# EAGLE schematic Ham-Dip-V2-005 (EAGLE 8.2.1)
VCC: 5v
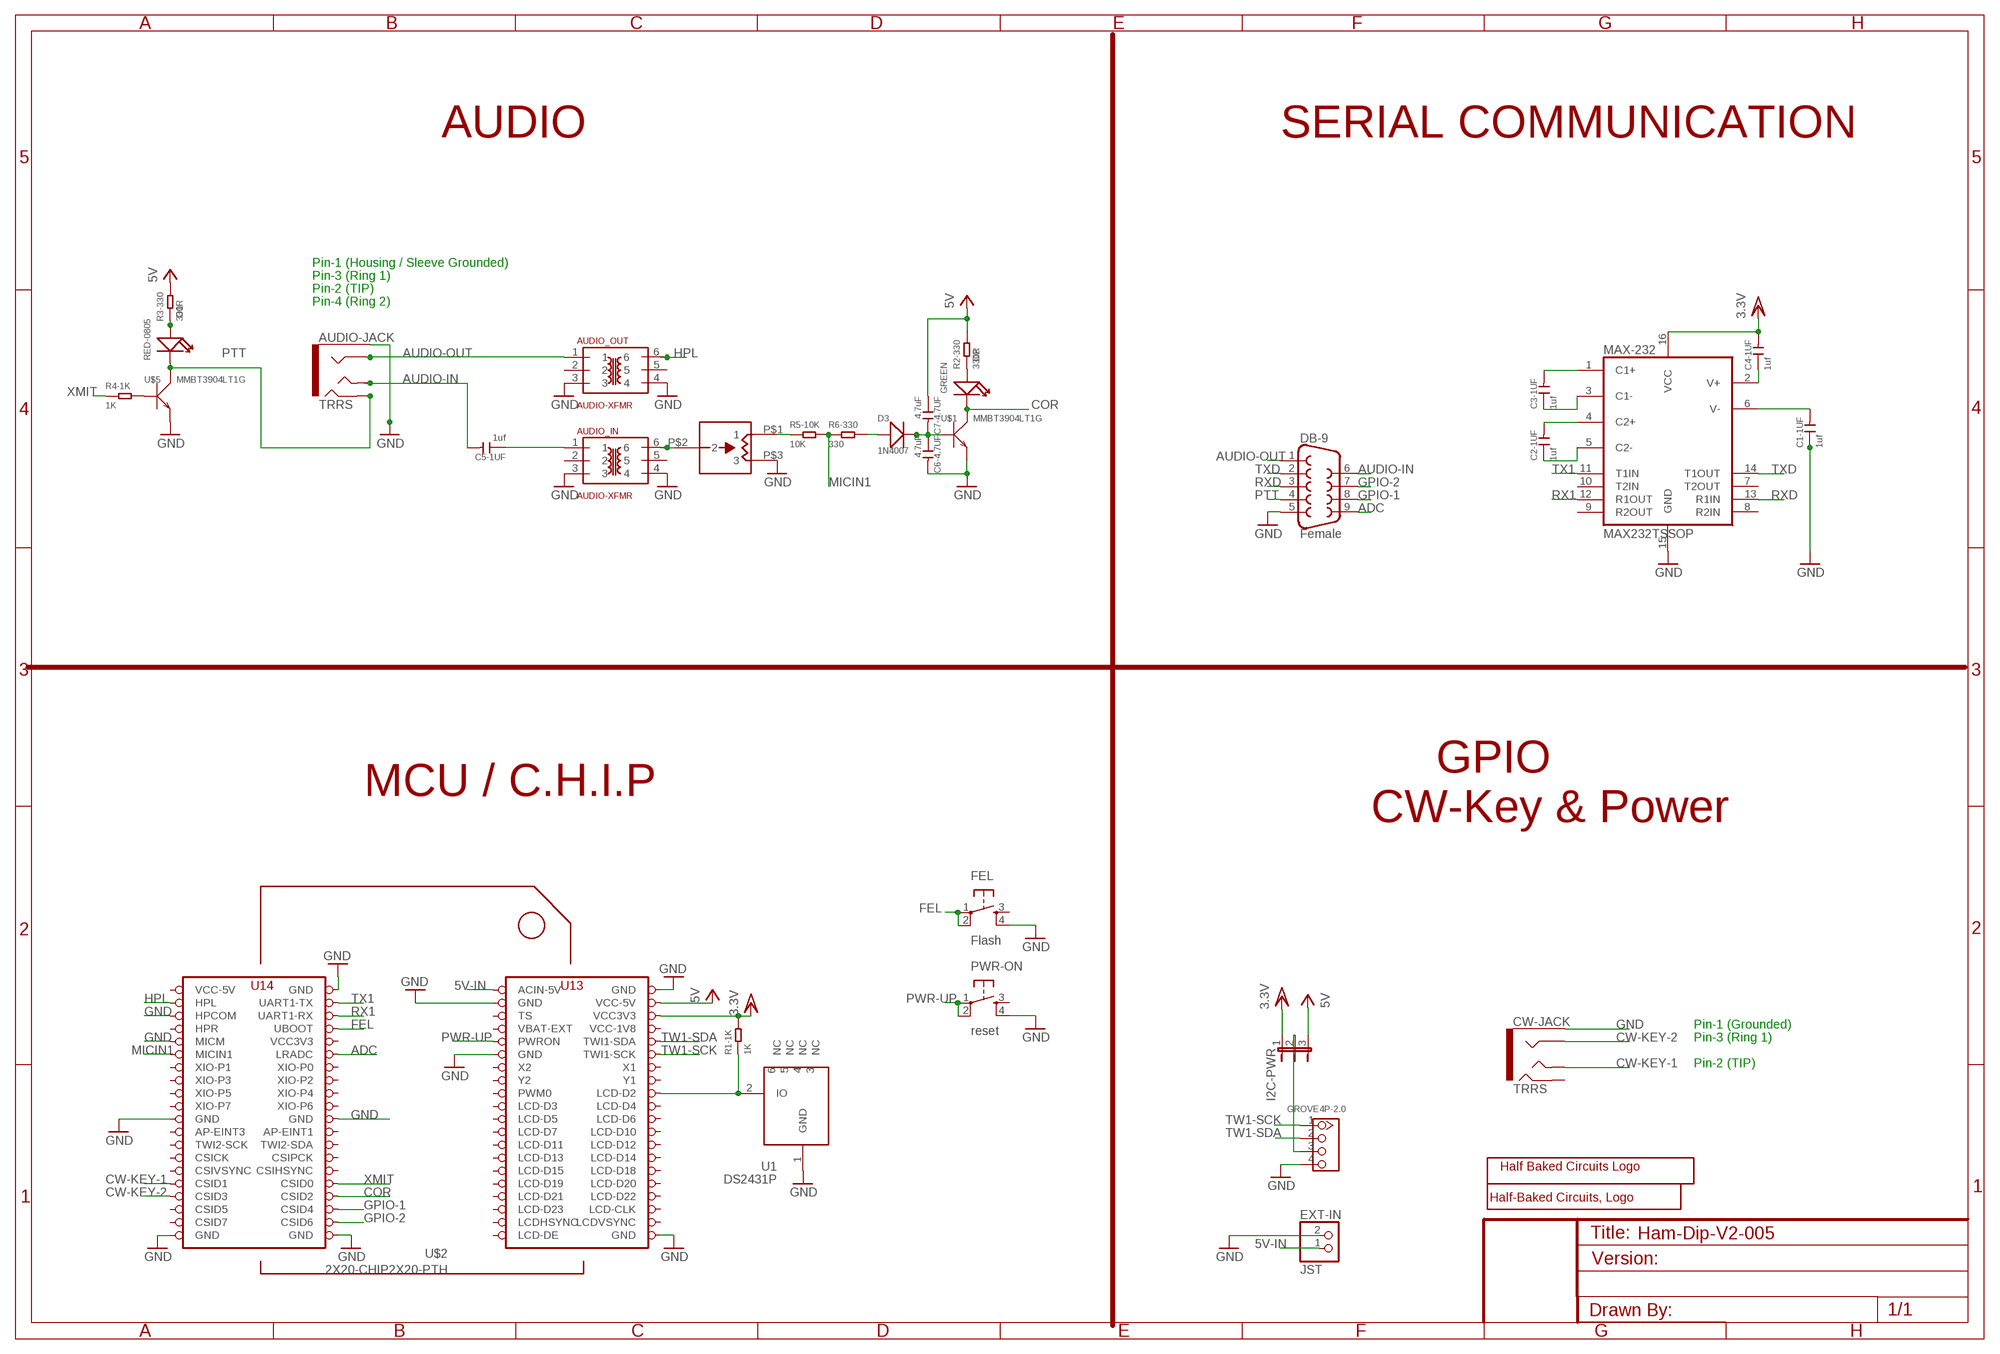
[diagram p0: schematic, sheet 1]

## Parts
AUDIO-JACK  TRRS  AUDIO-JACK3  [AUDIO-JACK-TRRS-SMD]
AUDIO_IN  AUDIO-XFMR  SM-LP-5001  [SM-LP-5001]
AUDIO_OUT  AUDIO-XFMR  SM-LP-5001  [SM-LP-5001]
C1-1UF  1uf  CERAMIC-1UF-25V-10%-X7R(0805)  [C0805]
C2-1UF  1uf  CERAMIC-1UF-25V-10%-X7R(0805)  [C0805]
C3-1UF  1uf  CERAMIC-1UF-25V-10%-X7R(0805)  [C0805]
C4-1UF  1uf  CERAMIC-1UF-25V-10%-X7R(0805)  [C0805]
C5-1UF  1uf  CERAMIC-1UF-25V-10%-X7R(0805)  [C0805]
C6-4.7UF  4.7uF  CERAMIC-1UF-25V-10%-X7R(0805)  [C0805]
C7-4.7UF  4.7uF  CERAMIC-1UF-25V-10%-X7R(0805)  [C0805]
CW-JACK  TRRS  AUDIO-JACK3  [AUDIO-JACK-TRRS-SMD]
D1  RED-0805  SMD-LED-CLEAR-RED(0805)  [LED-0805]
D2  GREEN  SMD-LED-CLEAR-RED(0805)  [LED-0805]
D3  1N4007  DIODE-GEN-PURPOSE-1KV-1A(DO-214AC)  [DO-214AC]
DB-9  Female  DB9FEMALE  [DB9]
EXT-IN  JST  JST_2PIN-THM  [JST-PH-2-THM]
FEL  Flash  TAC_SWITCHSMD  [TACTILE_SWITCH_SMD]
GROVE  4P-2.0  GROVE-CONNECTOR-DIP(4P-2.0)  [HW4-2.0]
I2C-PWR  JP2E  [JP2]
MAX-232  MAX232TSSOP  [TSSOP16]
MIC-LVL  1K  TC33X  [TC33X]
PWR-ON  reset  TAC_SWITCHSMD  [TACTILE_SWITCH_SMD]
R1-1K  1K  SMD-RES-220R-5%-1/8W(0805)  [R0805]
R2-330  330R  SMD-RES-220R-5%-1/8W(0805)  [R0805]
R3-330  330R  SMD-RES-220R-5%-1/8W(0805)  [R0805]
R4-1K  1K  SMD-RES-220R-5%-1/8W(0805)  [R0805]
R5-10K  10K  SMD-RES-10K-1%-1/8W(0805)  [R0805]
R6-330  330  SMD-RES-220R-5%-1/8W(0805)  [R0805]
U1  DS2431P  [TSOC6]
U$1  MMBT3904LT1G  SMD-TRANSISTORS-NPN-40V-200MA-MMBT3904LT1G(SOT-23)  [SOT-23]
U$2  2X20-CHIP2X20-PTH  2X20-CHIP2X20-PTH-CHIP_A  [2X20CHIP-TH]
U$3  HBC-LOGO  [HBC-LOGO]
U$4  HAM-DIP  [HAM-DIP]
U$5  MMBT3904LT1G  SMD-TRANSISTORS-NPN-40V-200MA-MMBT3904LT1G(SOT-23)  [SOT-23]

## Nets
5V-IN: EXT-IN.1 U$2.CHG-IN(ACIN-5V)
ADC: DB-9.9 U$2.LRADC
AUDIO-IN: AUDIO-JACK.TIP C5-1UF.2 DB-9.6
AUDIO-OUT: AUDIO-JACK.RING1 AUDIO_OUT.1 DB-9.1
COR: D2.- U$1.3(C) U$2.CSID2
CW-KEY-1: CW-JACK.TIP U$2.CSID1
CW-KEY-2: CW-JACK.RING1 U$2.CSID3
FEL: FEL.1 FEL.2 U$2.FEL(UBOOT)
GND: AUDIO-JACK.EARTH AUDIO_IN.3 AUDIO_IN.4 AUDIO_OUT.3 AUDIO_OUT.4 C1-1UF.1 C6-4.7UF.2 CW-JACK.EARTH DB-9.5 EXT-IN.2 FEL.4 GROVE.4 MAX-232.15(GND) MIC-LVL.P$3 PWR-ON.4 U1.1(GND) U$1.2(E) U$2.GND@1(GND) U$2.GND@2(GND) U$2.GND@3(GND) U$2.GND@4(GND) U$2.GND@5(GND) U$2.GND@6(GND) U$2.GND@7(GND) U$2.GND@8(GND) U$2.GND@10(GND) U$2.HPCOM U$2.MICM U$5.2(E)
GPIO-1: DB-9.8 U$2.CSID4
GPIO-2: DB-9.7 U$2.CSID6
HPL: AUDIO_OUT.6 U$2.HPL
IN: AUDIO_IN.1 C5-1UF.1
MICIN1: R5-10K.2 R6-330.1 U$2.MICIN1
N$1: D1.+ R3-330.1
N$3: MIC-LVL.P$1 R5-10K.1
N$4: AUDIO_IN.6 MIC-LVL.P$2
N$5: GROVE.3 I2C-PWR.2
N$6: C4-1UF.1 MAX-232.2(V+)
N$7: R1-1K.1 U1.2(IO) U$2.LCD-D2
N$8: R4-1K.2 U$5.1(B)
N$9: D2.+ R2-330.1
N$10: C6-4.7UF.1 C7-4.7UF.2 D3.2(-) U$1.1(B)
N$11: C1-1UF.2 MAX-232.6(V-)
N$12: D3.1(+) R6-330.2
N$16: C3-1UF.2 MAX-232.1(C1+)
N$17: C2-1UF.2 MAX-232.4(C2+)
N$18: C3-1UF.1 MAX-232.3(C1-)
N$19: C2-1UF.1 MAX-232.5(C2-)
PTT: AUDIO-JACK.RING2 D1.- DB-9.4 U$5.3(C)
PWR-UP: PWR-ON.1 PWR-ON.2 U$2.PWRON
RX1: MAX-232.12(R1OUT) U$2.UART1-RX
RXD: DB-9.3 MAX-232.13(R1IN)
TW1-SCK: GROVE.1 U$2.TWI1-SCK
TW1-SDA: GROVE.2 U$2.TWI1-SDA
TX1: MAX-232.11(T1IN) U$2.UART1-TX
TXD: DB-9.2 MAX-232.14(T1OUT)
VCC: C7-4.7UF.1 I2C-PWR.3 R2-330.2 R3-330.2 U$2.VCC5V@0(VCC-5V) ; supply symbol labelled 5V
VCC/2: C4-1UF.2 I2C-PWR.1 MAX-232.16(VCC) R1-1K.2 U$2.VCC3V3 ; supply symbol labelled 3.3V
XMIT: R4-1K.1 U$2.CSID0
Unconnected: AUDIO_IN.2 AUDIO_IN.5 AUDIO_OUT.2 AUDIO_OUT.5 CW-JACK.RING2 FEL.3 MAX-232.7(T2OUT) MAX-232.8(R2IN) MAX-232.9(R2OUT) MAX-232.10(T2IN) PWR-ON.3 U1.3(NC) U1.4(NC) U1.5(NC) U1.6(NC) U$2.AP-EINT1 U$2.AP-EINT3 U$2.BAT(VBAT-EXT) U$2.CSICK U$2.CSID5 U$2.CSID7 U$2.CSIHSYNC U$2.CSIPCK U$2.CSIVSYNC U$2.HPR U$2.LCD-CLK U$2.LCD-D3 U$2.LCD-D4 U$2.LCD-D5 U$2.LCD-D6 U$2.LCD-D7 U$2.LCD-D10 U$2.LCD-D11 U$2.LCD-D12 U$2.LCD-D13 U$2.LCD-D14 U$2.LCD-D15 U$2.LCD-D18 U$2.LCD-D19 U$2.LCD-D20 U$2.LCD-D21 U$2.LCD-D22 U$2.LCD-D23 U$2.LCD-DE U$2.LCD-HSYNC(LCDHSYNC) U$2.LCD-VSYNC(LCDVSYNC) U$2.PWM0 U$2.TS U$2.TWI2-SCK U$2.TWI2-SDA U$2.X1 U$2.X2 U$2.XIO-P0 U$2.XIO-P1 U$2.XIO-P2 U$2.XIO-P3 U$2.XIO-P4 U$2.XIO-P5 U$2.XIO-P6 U$2.XIO-P7 U$2.Y1 U$2.Y2

## Notes on the sheet
- AUDIO | SERIAL COMMUNICATION
- Pin-1 (Housing / Sleeve Grounded)
- Pin-3 (Ring 1)
- Pin-2 (TIP)
- Pin-4 (Ring 2)
- MCU / C.H.I.P
- GPIO
  CW-Key & Power
- Pin-1 (Grounded)
- Pin-3 (Ring 1)
- Pin-2 (TIP)

## Power pins joined to a net without a drawn wire
VCC3V3: U$2.VCC3V3@1(VCC3V3)
VCC-1V8: U$2.VCC1V8(VCC-1V8)
VCC-5V: U$2.VCC5V@1(VCC-5V)

## Library data of the parts
AUDIO-JACK CW-JACK = SparkFun-Connectors:AUDIO-JACK3: Audio jack - 3.5mm TRRS variety - two rings.
AUDIO_IN AUDIO_OUT = HalfBakedCircuits:SM-LP-5001
C1-1UF C2-1UF C3-1UF C4-1UF C5-1UF = Seeed-Capacitor-2016:CERAMIC-1UF-25V-10%-X7R(0805): 302010179; MPN: CC0805KKX7R8BB105
C6-4.7UF C7-4.7UF = Seeed-Capacitor-2016:CERAMIC-1UF-25V-10%-X7R(0805): 302010179; MPN: CC0805KKX7R8BB105; VALUE: 1uf
D1 = Seeed-LED-2016:SMD-LED-CLEAR-RED(0805): 304090046; MPN: 17-215SURC/S530-A2/TR8
D2 = Seeed-LED-2016:SMD-LED-CLEAR-RED(0805): 304090046; MPN: 17-215SURC/S530-A2/TR8; VALUE: RED-0805
D3 = Seeed-Diode:DIODE-GEN-PURPOSE-1KV-1A(DO-214AC): 304010013; MPN: 1N4007
DB-9 = SparkFun-Connectors:DB9: DB9 Connector Standard DB9 (D-Sub 9) serial connector. Can be used for CAN bus as well as RS485 and RS232. Footprint production proven. Here is the female version connector we sell at SparkFun: 9 Pin Female Serial Connector - PCB Mount <https://www.sparkfun.com/products/429> (PRT-00429) This connector has been used on the following SparkFun products: SparkFun RS232 Shifter - SMD <https://www.sparkfun.com/products/449> (PRT-00449) SparkFun RS232 Shifter SMD (No DB9) <https://www.sparkfun.com/products/8780> (PRT-08780); PROD_ID: CONN-08194
EXT-IN = adafruit:JST_2PIN: JST 2-Pin Connectors of various flavors SMT-RA (S2B-PH-SM4) 4UConnector #17311 SMT (B2B-PH-SM4) THM-RA (S2B-PH) THM (B2B-PH)
FEL PWR-ON = SparkFun-Electromechanical:TAC_SWITCH: Momentary Switch Button commonly used for reset or general input. Spark Fun Electronics SKU : COM-00097 SMT- SWCH-08247; PROD_ID: SWCH-08247
GROVE = Seeed-Connector -2016:GROVE-CONNECTOR-DIP(4P-2.0): 320110033
I2C-PWR = jumper:JP2E: JUMPER
MAX-232 = SparkFun-DigitalIC:MAX232: RS232 Transceiver Very common IC. This is generically called 'MAX232', but works with the 3V equivalent MAX3232 generic ICs. Field tested and mother approved. Spark Fun Electronics SKU : COM-00316 (DIP) and COM-00589 (SMD)
MIC-LVL = HalfBakedCircuits:TC33X
R1-1K R2-330 R3-330 R4-1K R6-330 = Seeed-Resistor-2016:SMD-RES-220R-5%-1/8W(0805): 301010315; MPN: RC0805JR-07220RL; VALUE: 220R
R5-10K = Seeed-Resistor-2016:SMD-RES-10K-1%-1/8W(0805): 301010361; MPN: RC0805FR-0710KL
U1 = JKW_CHIP:DS2431: 1024-Bit EEPROM This chip provides a 4x256 Bit EEPROM, which can be programmed@5V. Write protection and OTP emulation are available, too. Author: Jan Kandziora <jjj@gmx.de>; DESCRIPTION: IC, 1024-Bit, 1-Wire EEPROM, TSOC6; FOOTPRINT: TSOC6; LINK: http://www.digikey.com/product-detail/en/DS2431P%2BT%26R/DS2431P%2BT%26RCT-ND/3647900; MFG: DIGIKEY; MFG_PN: DS2431P+T&RCT-ND; PART_TYPE: IC; PRICE: 0.98; VENDOR: MAXIM; VENDOR_PART_NUMBER: DS2431P+T&R
U$1 U$5 = Seeed-Transistor-2016:SMD-TRANSISTORS-NPN-40V-200MA-MMBT3904LT1G(SOT-23): 305010013; MPN: MMBT3904LT1G
U$2 = JKW_CHIP:2X20-CHIP: Chip header; DESCRIPTION: 2x20 .100" headers; FOOTPRINT: 2x20 .100" CHIP foot print; VENDOR: ASSMANN; VENDOR_PART_NUMBER: AWHW40-G-SMD-R (single)
U$3 = HalfBakedCircuits:HBC-LOGO
U$4 = HalfBakedCircuits:HAM-DIP